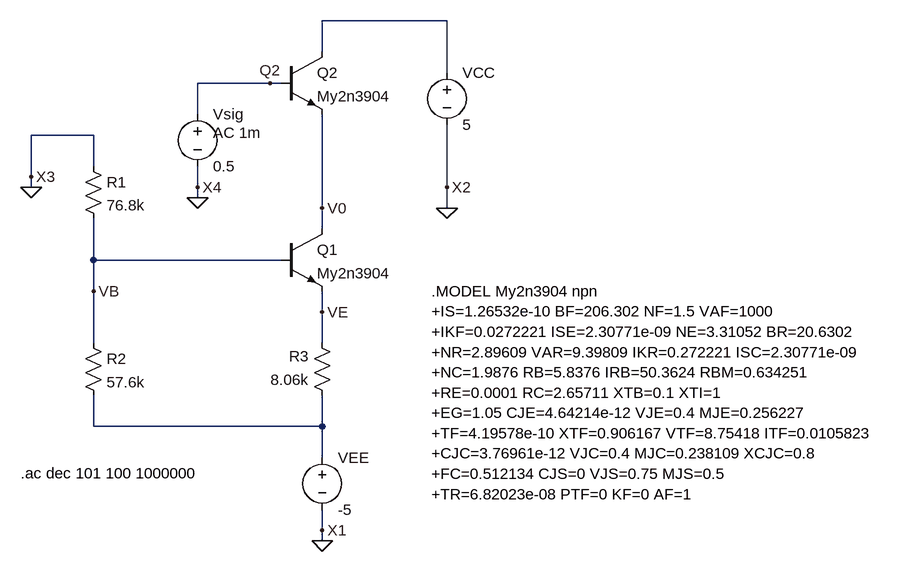
[diagram p0: schematic project3_p1.asc]
project3_p1.asc, the LTspice schematic file:
Version 4
SHEET 1 1432 700
WIRE 480 -224 288 -224
WIRE 288 -176 288 -224
WIRE 480 -144 480 -224
WIRE 208 -128 96 -128
WIRE 224 -128 208 -128
WIRE 96 -80 96 -128
WIRE -64 -48 -160 -48
WIRE -64 0 -64 -48
WIRE -160 16 -160 -48
WIRE -160 32 -160 16
WIRE 96 32 96 0
WIRE 480 32 480 -64
WIRE 96 48 96 32
WIRE 288 64 288 -80
WIRE 480 64 480 32
WIRE 288 96 288 64
WIRE -64 144 -64 80
WIRE 224 144 -64 144
WIRE -64 192 -64 144
WIRE 288 224 288 192
WIRE -64 272 -64 192
WIRE 288 272 288 224
WIRE -64 400 -64 352
WIRE 288 400 288 352
WIRE 288 400 -64 400
WIRE 288 448 288 400
WIRE 288 560 288 528
WIRE 288 576 288 560
FLAG -160 32 0
FLAG 480 64 0
FLAG 288 576 0
FLAG 288 560 X1
FLAG -160 16 X3
FLAG 480 32 X2
FLAG 288 64 V0
FLAG 288 224 VE
FLAG -64 192 VB
FLAG 96 48 0
FLAG 208 -128 Q2
FLAG 96 32 X4
SYMBOL npn 224 96 R0
SYMATTR InstName Q1
SYMATTR Value My2n3904
SYMBOL voltage 288 432 R0
WINDOW 123 0 0 Left 0
WINDOW 39 0 0 Left 0
SYMATTR InstName VEE
SYMATTR Value -5
SYMBOL voltage 480 -160 R0
WINDOW 123 0 0 Left 0
WINDOW 39 0 0 Left 0
SYMATTR InstName VCC
SYMATTR Value 5
SYMBOL res 304 368 R180
WINDOW 0 36 76 Left 2
WINDOW 3 36 40 Left 2
SYMATTR InstName R3
SYMATTR Value 8.06k
SYMBOL res -80 256 R0
SYMATTR InstName R2
SYMATTR Value 57.6k
SYMBOL res -80 -16 R0
SYMATTR InstName R1
SYMATTR Value 76.8k
SYMBOL voltage 96 -96 R0
WINDOW 123 24 44 Left 2
WINDOW 39 0 0 Left 0
SYMATTR Value2 AC 1m
SYMATTR InstName Vsig
SYMATTR Value 0.5
SYMBOL npn 224 -176 R0
SYMATTR InstName Q2
SYMATTR Value My2n3904
TEXT 456 192 Left 2 !.MODEL My2n3904 npn\n+IS=1.26532e-10 BF=206.302 NF=1.5 VAF=1000\n+IKF=0.0272221 ISE=2.30771e-09 NE=3.31052 BR=20.6302\n+NR=2.89609 VAR=9.39809 IKR=0.272221 ISC=2.30771e-09\n+NC=1.9876 RB=5.8376 IRB=50.3624 RBM=0.634251\n+RE=0.0001 RC=2.65711 XTB=0.1 XTI=1\n+EG=1.05 CJE=4.64214e-12 VJE=0.4 MJE=0.256227\n+TF=4.19578e-10 XTF=0.906167 VTF=8.75418 ITF=0.0105823\n+CJC=3.76961e-12 VJC=0.4 MJC=0.238109 XCJC=0.8\n+FC=0.512134 CJS=0 VJS=0.75 MJS=0.5\n+TR=6.82023e-08 PTF=0 KF=0 AF=1
TEXT -176 472 Left 2 !.ac dec 101 100 1000000

The netlist it stands for:
* project3_p1.asc
Q1 V0 VB VE 0 My2n3904
VEE N002 0 -5
VCC N001 0 5
R3 N002 VE 8.06k
R2 VB N002 57.6k
R1 0 VB 76.8k
Vsig Q2 0 0.5 AC 1m
Q2 N001 Q2 V0 0 My2n3904
.model NPN NPN
.model PNP PNP
.lib standard.bjt
.MODEL My2n3904 npn
+IS=1.26532e-10 BF=206.302 NF=1.5 VAF=1000
+IKF=0.0272221 ISE=2.30771e-09 NE=3.31052 BR=20.6302
+NR=2.89609 VAR=9.39809 IKR=0.272221 ISC=2.30771e-09
+NC=1.9876 RB=5.8376 IRB=50.3624 RBM=0.634251
+RE=0.0001 RC=2.65711 XTB=0.1 XTI=1
+EG=1.05 CJE=4.64214e-12 VJE=0.4 MJE=0.256227
+TF=4.19578e-10 XTF=0.906167 VTF=8.75418 ITF=0.0105823
+CJC=3.76961e-12 VJC=0.4 MJC=0.238109 XCJC=0.8
+FC=0.512134 CJS=0 VJS=0.75 MJS=0.5
+TR=6.82023e-08 PTF=0 KF=0 AF=1
.ac dec 101 100 1000000
.backanno
.end